# Altium schematic sheet COM-Radio-SBand.SchDoc
size A3
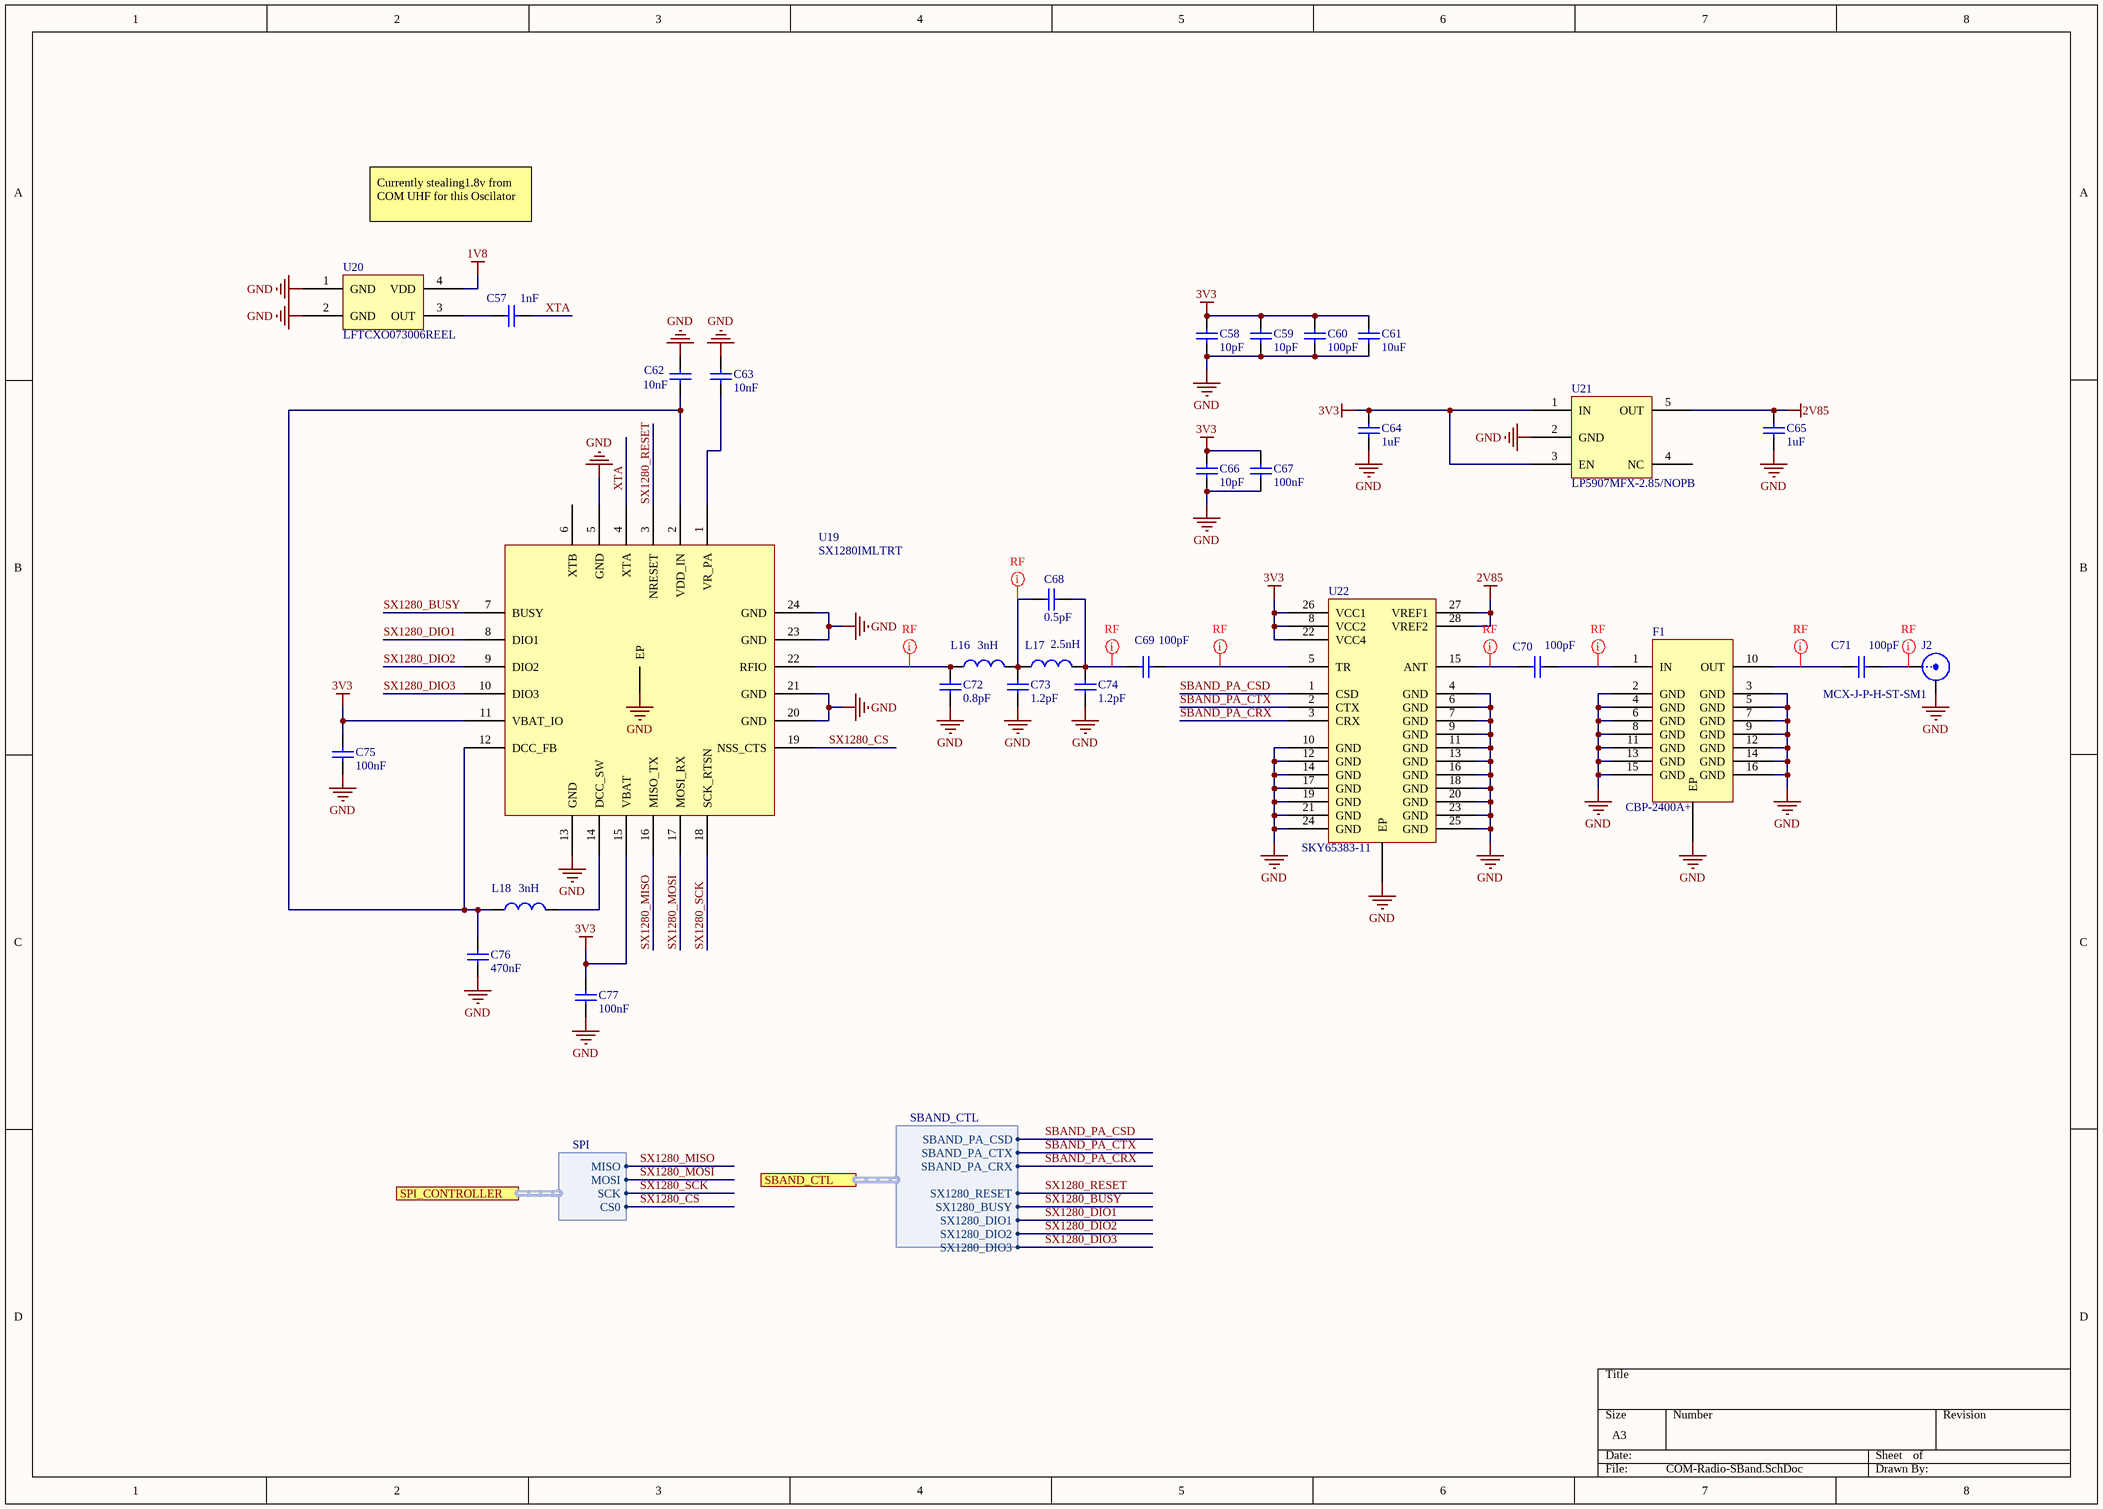
[diagram p0: COM-Radio-SBand.SchDoc]

## Parts
C57  Capacitance: 1nF  [1608[0603]]  (hidden comment: CL10B102KA8NNNC)
C58  Capacitance: 10pF  [1608[0603]]  (hidden comment: CL10C100JB8NCNC)
C59  Capacitance: 10pF  [1608[0603]]  (hidden comment: CL10C100JB8NCNC)
C60  Capacitance: 100pF  [1608[0603]]  (hidden comment: 500R14N101JV4T)
C61  Capacitance: 10uF  [1608[0603]]  (hidden comment: CL10A106MP8NNNC)
C62  Capacitance: 10nF  [1608[0603]]  (hidden comment: CL10B103KB8SFNC)
C63  Capacitance: 10nF  [1608[0603]]  (hidden comment: CL10B103KB8SFNC)
C64  Capacitance: 1uF  [1608[0603]]  (hidden comment: CL10B105MO8NNWC)
C65  Capacitance: 1uF  [1608[0603]]  (hidden comment: CL10B105MO8NNWC)
C66  Capacitance: 10pF  [1608[0603]]  (hidden comment: CL10C100JB8NCNC)
C67  Capacitance: 100nF  [1608[0603]]  (hidden comment: C0603C104J3RACAUTO)
C68  Capacitance: 0.5pF  [1608[0603]]  (hidden comment: CBR06C508B5GAC)
C69  Capacitance: 100pF  [1608[0603]]  (hidden comment: 500R14N101JV4T)
C70  Capacitance: 100pF  [1608[0603]]  (hidden comment: 500R14N101JV4T)
C71  Capacitance: 100pF  [1608[0603]]  (hidden comment: 500R14N101JV4T)
C72  Capacitance: 0.8pF  [1608[0603]]  (hidden comment: CL10C0R8BB8NNNC)
C73  Capacitance: 1.2pF  [1608[0603]]  (hidden comment: CL10C1R2BB8NNNC)
C74  Capacitance: 1.2pF  [1608[0603]]  (hidden comment: CL10C1R2BB8NNNC)
C75  Capacitance: 100nF  [1608[0603]]  (hidden comment: C0603C104J3RACAUTO)
C76  Capacitance: 470nF  [1608[0603]]  (hidden comment: CL10B474KA8NFNC)
C77  Capacitance: 100nF  [1608[0603]]  (hidden comment: C0603C104J3RACAUTO)
F1  CBP-2400A+  [CBP-2400A+]
J2  MCX-J-P-H-ST-SM1  [MCX-J-P-H-ST-SM1]
L16  Inductance: 3nH  [1608[0603]]  (hidden comment: L-14C3N3SV4T)
L17  Inductance: 2.5nH  [1608[0603]]  (hidden comment: LQW18AN2N4C80D)
L18  Inductance: 3nH  [1608[0603]]  (hidden comment: L-14C8N2JV4T)
U19  SX1280IMLTRT  [QFN50P400X400X80_HS-25N]
U20  LFTCXO073006REEL  [LFTCXO073006REEL]
U21  LP5907MFX-2.85/NOPB  [SOT95P280X145-5N]
U22  SKY65383-11  [PQFN70P600X600X85_HS-29N]

## Ports
SBAND_CTL (harness SBAND_CTL), SPI_CONTROLLER (harness SPI)

## Harnesses
SPI: MISO, MOSI, SCK, CS0
SBAND_CTL: SBAND_PA_CSD, SBAND_PA_CTX, SBAND_PA_CRX, SX1280_RESET, SX1280_BUSY, SX1280_DIO1, SX1280_DIO2, SX1280_DIO3

## Nets
1V8: U20.4(VDD)
2V85: C65.2 U21.5(OUT) U22.27(VREF1) U22.28(VREF2)
3V3: C58.2 C59.2 C60.2 C61.2 C64.2 C66.2 C67.2 C75.2 C77.2 U19.11(VBAT_IO) U19.15(VBAT) U21.1(IN) U21.3(EN) U22.8(VCC2) U22.22(VCC4) U22.26(VCC1)
GND: C58.1 C59.1 C60.1 C61.1 C62.2 C63.2 C64.1 C65.1 C66.1 C67.1 C72.1 C73.1 C74.1 C75.1 C76.1 C77.1 F1.2(GND) F1.3(GND) F1.4(GND) F1.5(GND) F1.6(GND) F1.7(GND) F1.8(GND) F1.9(GND) F1.11(GND) F1.12(GND) F1.13(GND) F1.14(GND) F1.15(GND) F1.16(GND) F1.17(EP) J2.2 U19.5(GND) U19.13(GND) U19.20(GND) U19.21(GND) U19.23(GND) U19.24(GND) U19.25(EP) U20.1(GND) U20.2(GND) U21.2(GND) U22.4(GND) U22.6(GND) U22.7(GND) U22.9(GND) U22.10(GND) U22.11(GND) U22.12(GND) U22.13(GND) U22.14(GND) U22.16(GND) U22.17(GND) U22.18(GND) U22.19(GND) U22.20(GND) U22.21(GND) U22.23(GND) U22.24(GND) U22.25(GND) U22.29(EP)
SBAND_PA_CRX: U22.3(CRX) ; port SBAND_CTL.SBAND_PA_CRX
SBAND_PA_CSD: U22.1(CSD) ; port SBAND_CTL.SBAND_PA_CSD
SBAND_PA_CTX: U22.2(CTX) ; port SBAND_CTL.SBAND_PA_CTX
SX1280_BUSY: U19.7(BUSY) ; port SBAND_CTL.SX1280_BUSY
SX1280_CS: U19.19(NSS_CTS) ; port SPI_CONTROLLER.CS0
SX1280_DIO1: U19.8(DIO1) ; port SBAND_CTL.SX1280_DIO1
SX1280_DIO2: U19.9(DIO2) ; port SBAND_CTL.SX1280_DIO2
SX1280_DIO3: U19.10(DIO3) ; port SBAND_CTL.SX1280_DIO3
SX1280_MISO: U19.16(MISO_TX) ; port SPI_CONTROLLER.MISO
SX1280_MOSI: U19.17(MOSI_RX) ; port SPI_CONTROLLER.MOSI
SX1280_RESET: U19.3(NRESET) ; port SBAND_CTL.SX1280_RESET
SX1280_SCK: U19.18(SCK_RTSN) ; port SPI_CONTROLLER.SCK
XTA: C57.1 U19.4(XTA)
NetC57_2: C57.2 U20.3(OUT)
NetC62_1: C62.1 C76.2 L18.2 U19.2(VDD_IN) U19.12(DCC_FB)
NetC63_1: C63.1 U19.1(VR_PA)
NetC68_1: C68.1 C69.2 C74.2 L17.1
NetC68_2: C68.2 C73.2 L16.1 L17.2
NetC69_1: C69.1 U22.5(TR)
NetC70_1: C70.1 U22.15(ANT)
NetC70_2: C70.2 F1.1(IN)
NetC71_1: C71.1 F1.10(OUT)
NetC71_2: C71.2 J2.1
NetC72_2: C72.2 L16.2 U19.22(RFIO)
NetL18_1: L18.1 U19.14(DCC_SW)

Not connected (* = marked no-connect by the designer): U19 6(XTB); U21 4(NC)

## Layout directives
net class RF: NetC68_1, NetC68_2, NetC69_1, NetC70_1, NetC70_2, NetC71_1, NetC71_2, NetC72_2

## Notes on the sheet
- Currently stealing1.8v from COM UHF for this Oscilator

## Library data of the parts
C57 = 27258: CAP CER 1000PF 25V X7R 0603; PartNumber: CBR04C100J5GAC; Manufacturer: Kemet; ID: 27258; Tolerance: 5%; Category: Ceramic; Status: Unchecked; Package: 0402 (1005 Metric); ComponentLink1Description: Datasheet; ComponentLink1URL: http://www.mouser.com/catalog/catalogusd/646/990.pdf
C58 C59 C66 = 27258: CAP CER 10PF 50V C0G/NP0 0603; PartNumber: CBR04C100J5GAC; Manufacturer: Kemet; ID: 27258; Tolerance: 5%; Category: Ceramic; Status: Unchecked; Package: 0402 (1005 Metric); ComponentLink1Description: Datasheet; ComponentLink1URL: http://www.mouser.com/catalog/catalogusd/646/990.pdf
C60 C69 = 27258: CAP CER 100PF 50V C0G/NP0 0603; PartNumber: CBR04C100J5GAC; Manufacturer: Kemet; ID: 27258; Tolerance: 5%; Category: Ceramic; Status: Unchecked; Package: 0402 (1005 Metric); ComponentLink1Description: Datasheet; ComponentLink1URL: http://www.mouser.com/catalog/catalogusd/646/990.pdf
C61 = 27258: CAP CER 10UF 10V X5R 0603; PartNumber: CBR04C100J5GAC; Manufacturer: Kemet; ID: 27258; Tolerance: 5%; Category: Ceramic; Status: Unchecked; Package: 0402 (1005 Metric); ComponentLink1Description: Datasheet; ComponentLink1URL: http://www.mouser.com/catalog/catalogusd/646/990.pdf
C62 C63 = 27258: CAP CER 10000PF 50V X7R 0603; PartNumber: CBR04C100J5GAC; Manufacturer: Kemet; ID: 27258; Tolerance: 5%; Category: Ceramic; Status: Unchecked; Package: 0402 (1005 Metric); ComponentLink1Description: Datasheet; ComponentLink1URL: http://www.mouser.com/catalog/catalogusd/646/990.pdf
C64 C65 = 4997: CAP CER 1UF 16V X7R 0603; PartNumber: CGA2B2X7R1H102M050BA; Manufacturer: TDK; ID: 4997; Tolerance: ±20%; Category: Ceramic; Status: Unchecked; Package: 0402 (1005 Metric); ComponentLink1Description: Datasheet; ComponentLink1URL: http://product.tdk.com/capacitor/mlcc/en/documents/mlcc_automotive_general_en.pdf
C67 C75 C77 = 27258: CAP CER 0.1UF 25V X7R 0603; PartNumber: CBR04C100J5GAC; Manufacturer: Kemet; ID: 27258; Tolerance: 5%; Category: Ceramic; Status: Unchecked; Package: 0402 (1005 Metric); ComponentLink1Description: Datasheet; ComponentLink1URL: http://www.mouser.com/catalog/catalogusd/646/990.pdf
C68 = 27258: CAP CER 0.5PF 50V C0G/NP0 0603; PartNumber: CBR04C100J5GAC; Manufacturer: Kemet; ID: 27258; Tolerance: 5%; Category: Ceramic; Status: Unchecked; Package: 0402 (1005 Metric); ComponentLink1Description: Datasheet; ComponentLink1URL: http://www.mouser.com/catalog/catalogusd/646/990.pdf
C70 C71 = 4997: CAP CER 100PF 50V C0G/NP0 0603; PartNumber: CGA2B2X7R1H102M050BA; Manufacturer: TDK; ID: 4997; Tolerance: ±20%; Category: Ceramic; Status: Unchecked; Package: 0402 (1005 Metric); ComponentLink1Description: Datasheet; ComponentLink1URL: http://product.tdk.com/capacitor/mlcc/en/documents/mlcc_automotive_general_en.pdf
C72 = 27258: CAP CER 0.8PF 50V C0G/NP0 0603; PartNumber: CBR04C100J5GAC; Manufacturer: Kemet; ID: 27258; Tolerance: 5%; Category: Ceramic; Status: Unchecked; Package: 0402 (1005 Metric); ComponentLink1Description: Datasheet; ComponentLink1URL: http://www.mouser.com/catalog/catalogusd/646/990.pdf
C73 C74 = 27258: CAP CER 1.2PF 50V C0G/NP0 0603; PartNumber: CBR04C100J5GAC; Manufacturer: Kemet; ID: 27258; Tolerance: 5%; Category: Ceramic; Status: Unchecked; Package: 0402 (1005 Metric); ComponentLink1Description: Datasheet; ComponentLink1URL: http://www.mouser.com/catalog/catalogusd/646/990.pdf
C76 = 27258: CAP CER 0.47UF 25V X7R 0603; PartNumber: CBR04C100J5GAC; Manufacturer: Kemet; ID: 27258; Tolerance: 5%; Category: Ceramic; Status: Unchecked; Package: 0402 (1005 Metric); ComponentLink1Description: Datasheet; ComponentLink1URL: http://www.mouser.com/catalog/catalogusd/646/990.pdf
F1 = CBP-2400A+: CBP-2400A+ is a ceramic-coaxial-resonator based bandpass filter in a shielded package fabricated using SMT / technology. This filter offers outstanding close-in rejection, low insertion loss and high power handling for use in / mobile satellite, ISM and amateur radio
J2 = MMCX-J-P-H-RA-TH1: MCX Connector Jack, Female Socket 50 Ohm Surface Mount Solder; PartNumber: MMCX-J-P-H-RA-TH1
L16 = 25811: FIXED IND 3.3NH 300MA 200 MOHM; PartNumber: MLG1005SR18JT000; Manufacturer: TDK; ID: 25811; DCR: 3.8 Ohm Max; Current: 150mA; Category: Chip Inductor; Status: Unchecked; Package: 0402 (1005 Metric); ComponentLink1Description: Datasheet; ComponentLink1URL: http://www.tdk.co.jp/tefe02/e521_mlg.pdf
L17 = 25811: FIXED IND 2.4NH 2.4A 26 MOHM SMD; PartNumber: MLG1005SR18JT000; Manufacturer: TDK; ID: 25811; DCR: 3.8 Ohm Max; Current: 150mA; Category: Chip Inductor; Status: Unchecked; Package: 0402 (1005 Metric); ComponentLink1Description: Datasheet; ComponentLink1URL: http://www.tdk.co.jp/tefe02/e521_mlg.pdf
L18 = 25811: FIXED IND 8.2NH 300MA 330 MOHM; PartNumber: MLG1005SR18JT000; Manufacturer: TDK; ID: 25811; DCR: 3.8 Ohm Max; Current: 150mA; Category: Chip Inductor; Status: Unchecked; Package: 0402 (1005 Metric); ComponentLink1Description: Datasheet; ComponentLink1URL: http://www.tdk.co.jp/tefe02/e521_mlg.pdf
U19 = SX1280IMLTRT: IC RF TxRx Only 802.15.4 LoRa™ 2.4GHz 24-WFQFN Exposed Pad
U20 = LFTCXO073006REEL: 50MHz TCXO Clipped Sine Wave Oscillator 2.8 V ~ 3.3 V 4-SMD, No Lead
U21 = LP5907MFX-2.85/NOPB: Linear Voltage Regulator IC 1 Output 250mA SOT-23-5
U22 = SKY65383-11: RF Front End 2.4GHz ~ 2.483 GHz ISM 28-MCM (6x6)